# EAGLE design ensearrosage_2 (EAGLE 9.6.2)
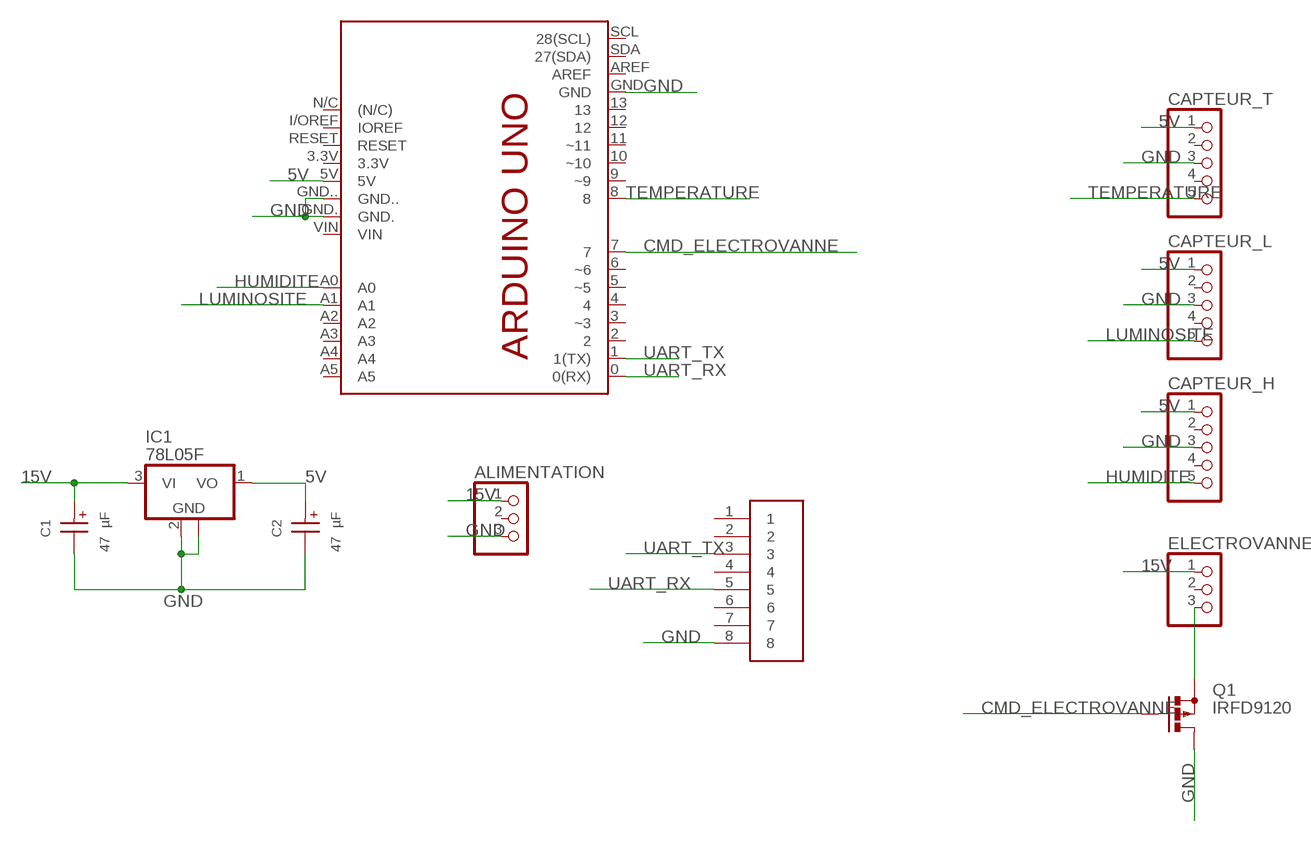
[diagram p0: schematic, sheet 1]

## Parts
ALIMENTATION  PINHD-1X3  [1X03]
C1  47 µF  WCAP-ASLI_5X5.5_865080342006  [WCAP-ASLI_5X5.5(DXL)]
C2  47 µF  WCAP-ASLI_5X5.5_865080342006  [WCAP-ASLI_5X5.5(DXL)]
CAPTEUR_H  PINHD-1X5  [1X05]
CAPTEUR_L  PINHD-1X5  [1X05]
CAPTEUR_T  PINHD-1X5  [1X05]
ELECTROVANNE  PINHD-1X3  [1X03]
IC1  78L05F  [SOT89]
PCB1  ARDUINO_UNO  [ARDUINO_UNO]
Q1  IRFD9120  [C370-01]
U$2  RJ45  [RJ45]

## Nets
5V: C2.1(+) CAPTEUR_H.1 CAPTEUR_L.1 CAPTEUR_T.1 IC1.1(VO) PCB1.5V
15V: ALIMENTATION.1 C1.1(+) ELECTROVANNE.1 IC1.3(VI)
CMD_ELECTROVANNE: PCB1.7 Q1.G
GND: ALIMENTATION.3 C1.2(-) C2.2(-) CAPTEUR_H.3 CAPTEUR_L.3 CAPTEUR_T.3 IC1.2(GND) IC1.2@1(GND) PCB1.GND PCB1.GND. PCB1.GND.. Q1.D Q1.D1(D) U$2.8
HUMIDITE: CAPTEUR_H.5 PCB1.A0
LUMINOSITE: CAPTEUR_L.5 PCB1.A1
N$1: ELECTROVANNE.3 Q1.S
TEMPERATURE: CAPTEUR_T.5 PCB1.8
UART_RX: PCB1.0(0(RX)) U$2.5
UART_TX: PCB1.1(1(TX)) U$2.3
Unconnected: ALIMENTATION.2 CAPTEUR_H.2 CAPTEUR_H.4 CAPTEUR_L.2 CAPTEUR_L.4 CAPTEUR_T.2 CAPTEUR_T.4 ELECTROVANNE.2 PCB1.2 PCB1.3(~3) PCB1.3.3V PCB1.4 PCB1.5(~5) PCB1.6(~6) PCB1.9(~9) PCB1.10(~10) PCB1.11(~11) PCB1.12 PCB1.13 PCB1.A2 PCB1.A3 PCB1.A4 PCB1.A5 PCB1.AREF PCB1.I/OREF(IOREF) PCB1.N/C((N/C)) PCB1.RESET PCB1.SCL(28(SCL)) PCB1.SDA(27(SDA)) PCB1.VIN U$2.1 U$2.2 U$2.4 U$2.6 U$2.7

## Library data of the parts
ALIMENTATION ELECTROVANNE = pinhead:PINHD-1X3: PIN HEADER
C1 C2 = Eagle_WCAP-ASLI (rev20a):WCAP-ASLI_5X5.5: WCAP-ASLI Aluminium Electrolytic Capacitors Low Impedance +105 °C Characteristics Low impedance product series Mounting style: V-Chip SMT Capacitance range: 0.1 µF ‒ 6800 µF Capacitance tolerance: ±20 % Voltage range (UR): 6.3 ‒ 100 V(DC) Operating temperature: -55 °C up to +105 °C Endurance: 2000 h @ +105 °C Dimensions (DxL) in mm: 4.0 x 5.5 up to 16.0 x 17.0 Recommended soldering: Reflow soldering Applications Low impedance, especially for filtering applications Input and output capacitor for switched-mode power supply Filtering Smoothing e.g. DC/DC converter, AC/DC converter, satellite receiver, control panel <https://www.we-online.com/catalog/media/o14723v209%20Family_WCAP-ASLI.jpg> Details see: https://www.we-online.com/catalog/en/WCAP-ASLI/ Updated by yingchun,Shan;2020-03-03 2020(C) Würth Elektronik; DATASHEET-URL: https://www.we-online.com/catalog/datasheet/865080342006.pdf; DF: 16%; DIAMETER: 5mm; I-LEAK: 7.52uA; I-RIPPLE: 195mA; L: 5.5mm; OPERATING-TEMPERATURE: -55 °C up to +105 °C; PART-NUMBER: 865080342006; TECHNICAL-REFERENCE: ASEC055470M016DVCTBB000; VR: 16V(DC)
CAPTEUR_H CAPTEUR_L CAPTEUR_T = pinhead:PINHD-1X5: PIN HEADER
IC1 = linear:78L*: POSITOIV-VOLTAGE REGULATORS Output up to 100 mA Source: Datasheet <http://focus.ti.com/lit/ds/symlink/ua78l05.pdf>
PCB1 = E14_Arduino_custom:ARDUINO_UNO: Device for representing an Arduino Uno board with a footprint in an EAGLE design. Created by Dave Young for Element14. More EAGLE documentation at: http://www.element14.com/community/community/knode/cadsoft_eagle
Q1 = transistor-small-signal:IRFD9120: P-CHANNEL MOS FET
U$2 = rj45-connector:RJ45

## Board
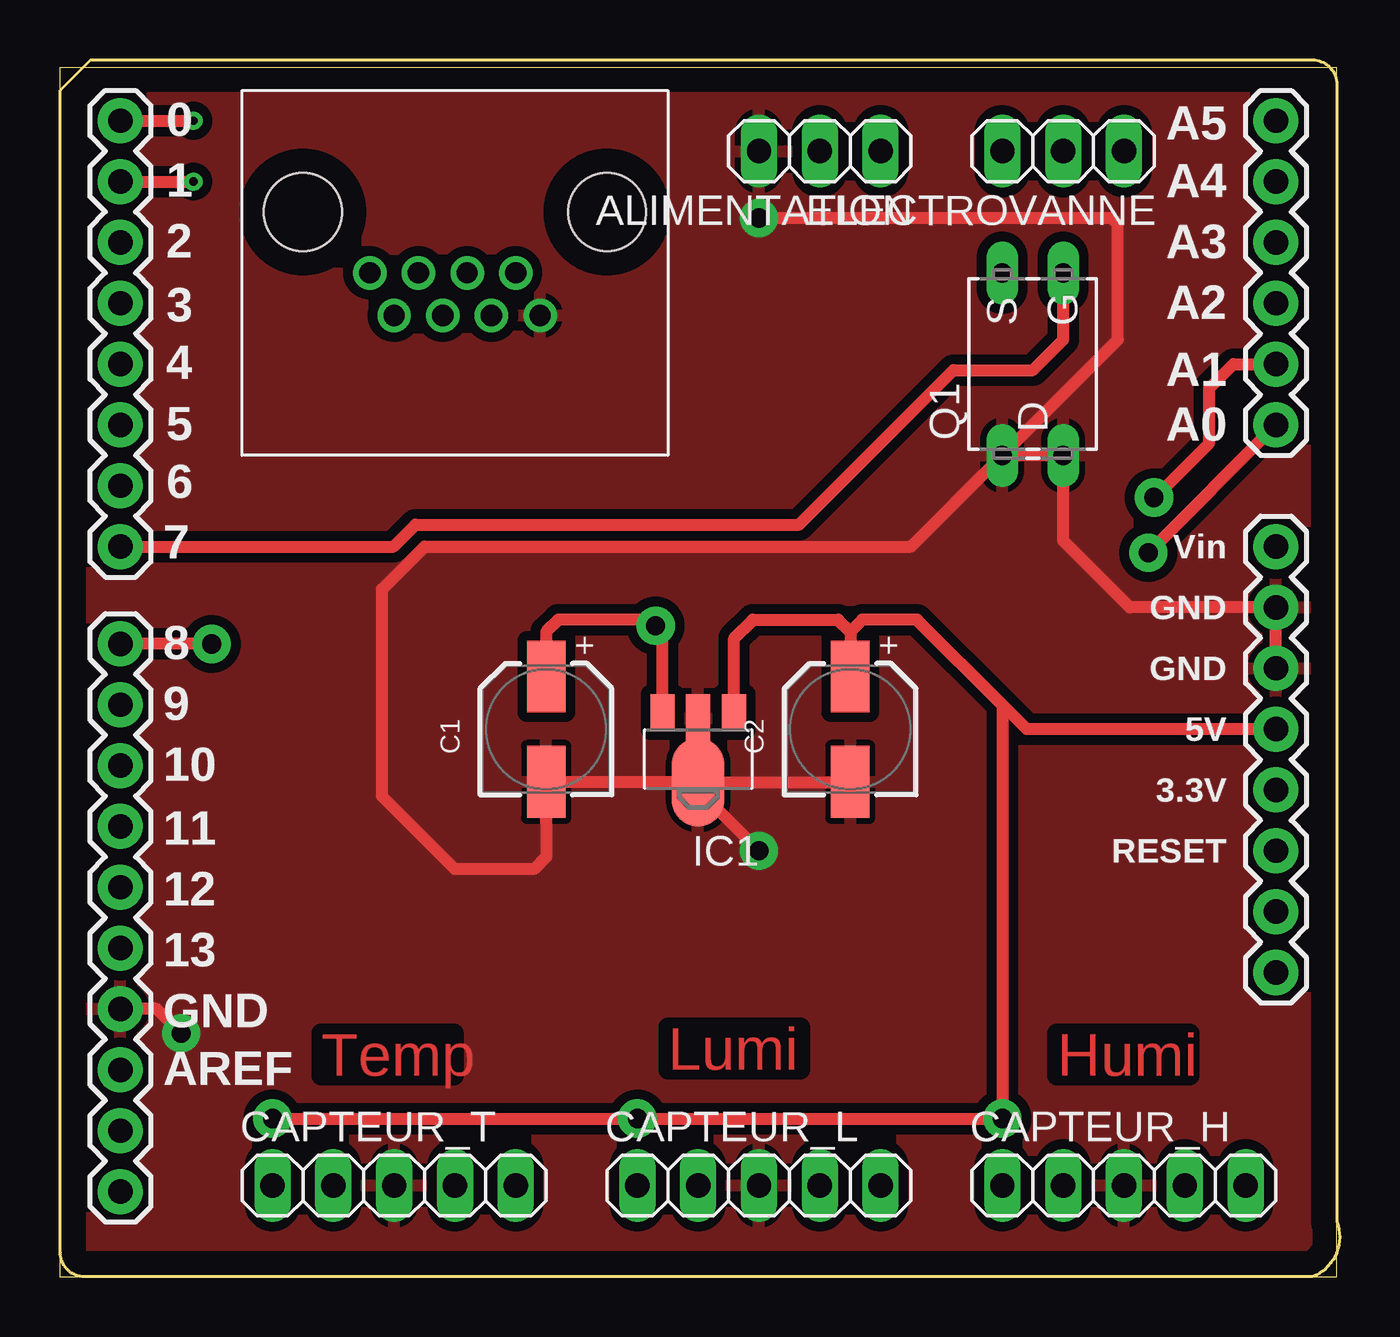
[diagram p1: board, top side]
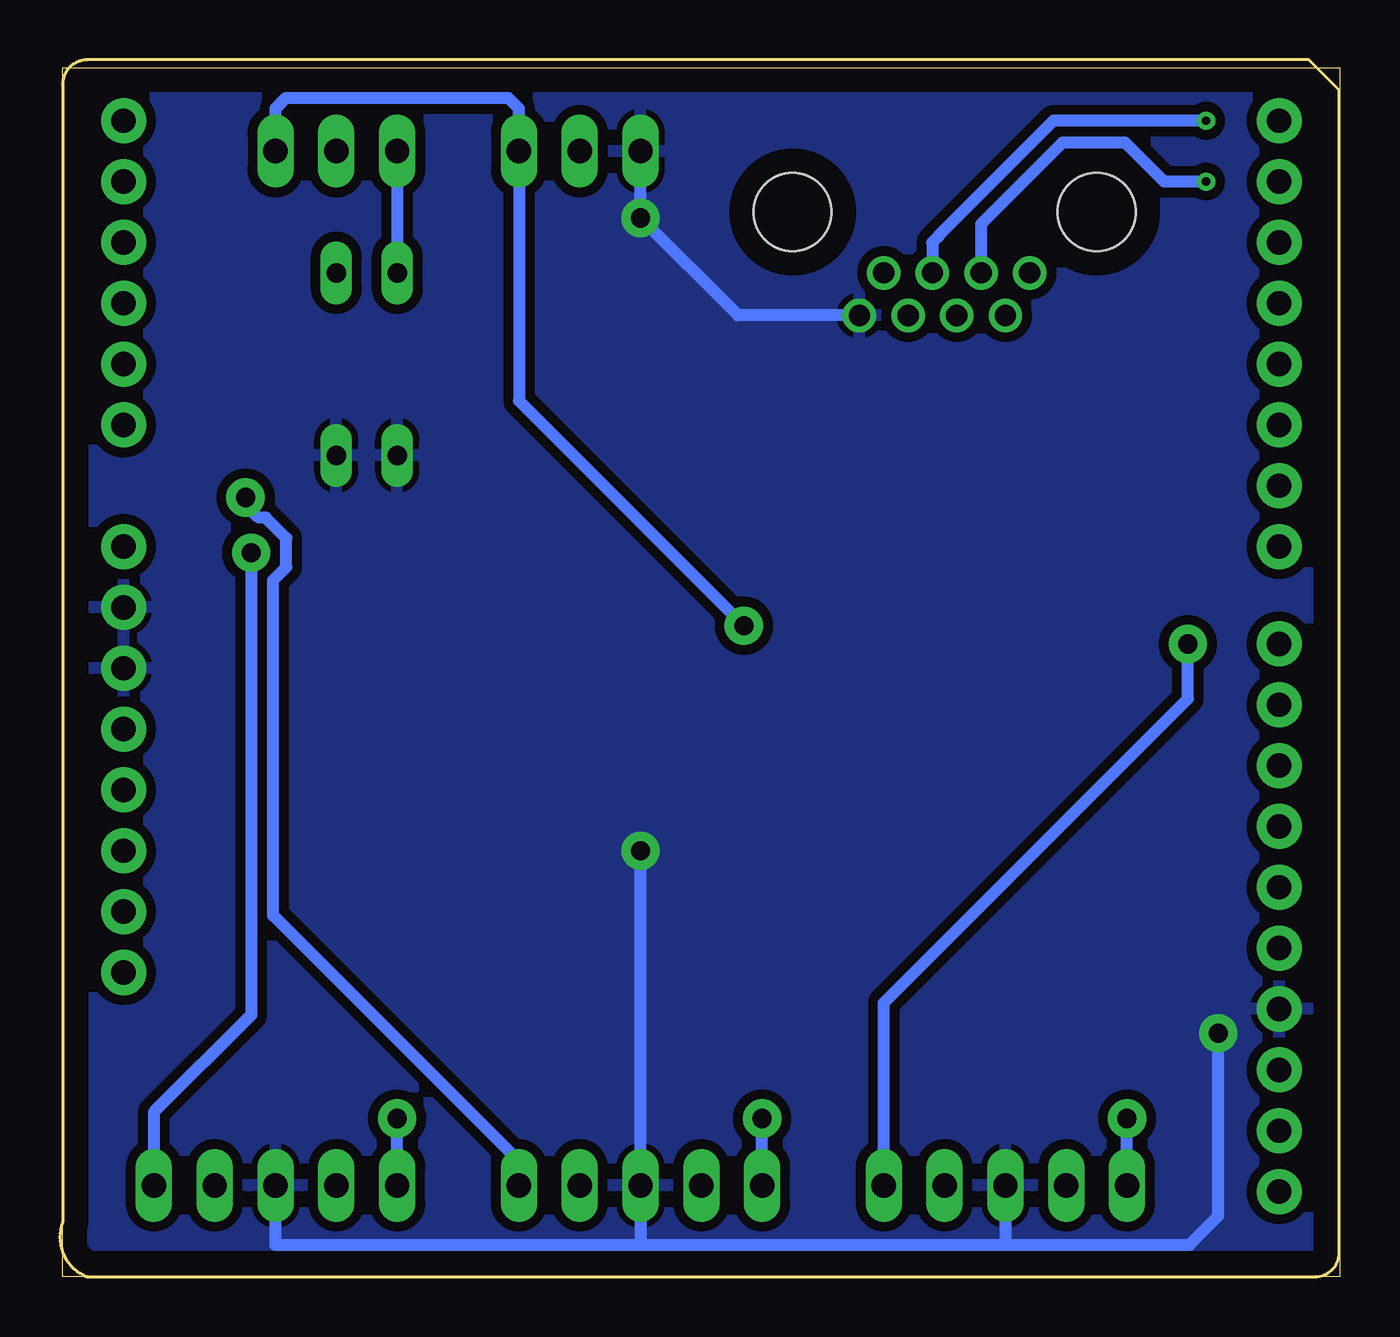
[diagram p2: board, bottom side, seen from below]

Size 53.33 x 50.47 mm. Coordinates in mm from the lower left corner, seen from the top.
Outline: 53.33,0 53.33,50.47 0,50.47 0,0 53.33,0
Copper layers (1*16): Top 0.035mm / dielectric 1.5mm / Bottom 0.035mm
Design rules "default *": minimum track width 20mil, minimum drill 0.35mm, track to track 16mil, track to pad 16mil, pad to pad 16mil, via to via 6mil, smd to smd 6mil, copper to edge 40mil, drill to drill 6mil, minimum pad ring 10mil, minimum via ring 8mil, stop-mask expansion 4mil, vias tented up to drill 0mil, thermal gap 10mil

### Footprints (pad centres in the part's own frame; a part is rotated, then mirrored left to right if it is on the bottom)
1X03 = drill 1.016 long: 1 -2.54,0; 2 0,0; 3 2.54,0
WCAP-ASLI_5X5.5(DXL) = smd 3 x 1.6: 1 2.2,0; 2 -2.2,0
1X05 = drill 1.016 long: 1 -5.08,0; 2 -2.54,0; 3 0,0; 4 2.54,0; 5 5.08,0
SOT89 = smd 1 x 1.5: 1 -1.499,-1.981; 3 1.499,-1.981 | smd 1 x 2: 2 0,-1.727 | smd 2.2 x 3.7: 2@1 0,0.94
ARDUINO_UNO = drill 1.016 pad 1.88: 0 48.26,50.8; 1 45.72,50.8; 2 43.18,50.8; 3 40.64,50.8; 3.3V 20.32,2.54; 4 38.1,50.8; 5 35.56,50.8; 5V 22.86,2.54; 6 33.02,50.8; 7 30.48,50.8; 8 26.416,50.8; 9 23.876,50.8; 10 21.336,50.8; 11 18.796,50.8; 12 16.256,50.8; 13 13.716,50.8; A0 35.56,2.54; A1 38.1,2.54; A2 40.64,2.54; A3 43.18,2.54; A4 45.72,2.54; A5 48.26,2.54; AREF 8.636,50.8; GND 11.176,50.8; GND. 27.94,2.54; GND.. 25.4,2.54; I/OREF 15.24,2.54; N/C 12.7,2.54; RESET 17.78,2.54; SCL 3.556,50.8; SDA 6.096,50.8; VIN 30.48,2.54
C370-01 = drill 0.813 long: D -3.81,1.27; D1 -3.81,-1.27; G 3.81,-1.27; S 3.81,1.27
RJ45 = drill 0.889: 1 9.906,2.54; 2 8.89,4.318; 3 7.874,2.54; 4 6.858,4.318; 5 5.842,2.54; 6 4.826,4.318; 7 3.81,2.54; 8 2.794,4.318 | hole 3.251: 0,0; 12.7,0

### Placement (x,y rotation side)
ALIMENTATION  31.74,46.99 180 top
C1  20.31,22.86 90 top
C2  33.01,22.86 90 top
CAPTEUR_H  44.44,3.81 0 top
CAPTEUR_L  29.2,3.81 0 top
CAPTEUR_T  13.96,3.81 0 top
ELECTROVANNE  41.9,46.99 180 top
IC1  26.66,21.59 180 top
PCB1  53.33,0 90 top
Q1  40.63,38.1 90 top
U$2  22.85,44.45 180 top

### Tracks (layer width: path | path; a pad name or v marks a point on that pad's centre or on a via)
5V  (via drill 0.8 pad 1.6)
  Top 0.508: IC1.1 28.16,26.64 28.95,27.43 32.5,27.43 33.01,26.92 | 33.01,26.92 C2.1 | PCB1.5V 40.38,22.86 39.36,23.88 | 33.01,26.92 33.52,27.43 35.8,27.43 39.36,23.88 | v8.88,6.6 v24.12,6.6 v39.36,6.6 39.36,23.88
  Bottom 0.508: CAPTEUR_L.1 v24.12,6.6 | CAPTEUR_T.1 v8.88,6.6 | CAPTEUR_H.1 v39.36,6.6
15V  (via drill 0.8 pad 1.6)
  Top 0.508: IC1.3 25.16,26.9 v24.88,27.18 24.63,27.43 20.82,27.43 20.31,26.92 C1.1
  Bottom 0.508: ELECTROVANNE.1 44.44,48.77 44.01,49.2 34.71,49.2 34.28,48.77 ALIMENTATION.1 34.28,36.58 v24.88,27.18
CMD_ELECTROVANNE
  Top 0.508: PCB1.7 13.94,30.48 14.85,31.39 30.88,31.39 37.33,37.85 40.63,37.85 41.9,39.12 Q1.G
GND  (via drill 0.8 pad 1.6)
  Top 0.508: IC1.2 IC1.2@1 | IC1.2@1 C1.2 20.31,17.53 19.8,17.02 16.5,17.02 13.45,20.07 13.45,28.7 15.23,30.48 35.55,30.48 Q1.D | IC1.2@1 C2.2 | v5.07,10.16 4.05,11.18 PCB1.GND | v29.2,17.78 26.66,20.32 IC1.2@1 | PCB1.GND.. PCB1.GND. 44.69,27.94 41.9,30.73 Q1.D1 Q1.D | Q1.D 44.19,39.12 44.19,43.94 43.93,44.2 v29.2,44.2
  Bottom 0.508: CAPTEUR_H.3 44.44,1.33 29.2,1.33 | 29.2,1.33 13.96,1.33 | 13.96,1.33 6.28,1.33 5.07,2.54 v5.07,10.16 | 29.2,1.33 CAPTEUR_L.3 v29.2,17.78 | CAPTEUR_T.3 13.96,1.33 | ALIMENTATION.3 v29.2,44.2 25.14,40.13 U$2.8
  pour Bottom: -0.01,0 53.33,0 53.33,50.55 -0.01,50.55
  pour Top: -0.01,0 53.33,0 53.33,50.55 -0.01,50.55
HUMIDITE  (via drill 0.8 pad 1.6)
  Top 0.508: PCB1.A0 v45.46,30.23
  Bottom 0.508: v45.46,30.23 45.46,10.92 49.52,6.86 CAPTEUR_H.5
LUMINOSITE  (via drill 0.8 pad 1.6)
  Top 0.508: v45.69,32.53 45.73,32.53 48,34.8 48,37.08 49.01,38.1 PCB1.A1
  Bottom 0.508: CAPTEUR_L.5 34.28,4.83 44.54,15.09 44.54,29.07 44,29.62 44,30.83 44.85,31.69 45.14,31.69 45.69,32.24 v45.69,32.53
N$1
  Bottom 0.508: ELECTROVANNE.3 Q1.S
TEMPERATURE  (via drill 0.8 pad 1.6)
  Top 0.508: v6.34,26.42 PCB1.8
  Bottom 0.508: CAPTEUR_T.5 19.04,11.43 6.34,24.13 v6.34,26.42
UART_RX  (via drill 0.35)
  Top 0.508: PCB1.0 v5.58,48.26
  Bottom 0.508: v5.58,48.26 11.95,48.26 16.75,43.46 16.75,43.43 17.01,43.18 U$2.5
UART_TX  (via drill 0.35)
  Top 0.508: PCB1.1 v5.58,45.72
  Bottom 0.508: v5.58,45.72 7.33,45.72 8.95,47.35 11.57,47.35 14.98,43.94 U$2.3

### Text on the board
Top: Lumi | Temp | Humi